# EAGLE design micADM510 (EAGLE 9.2.2)
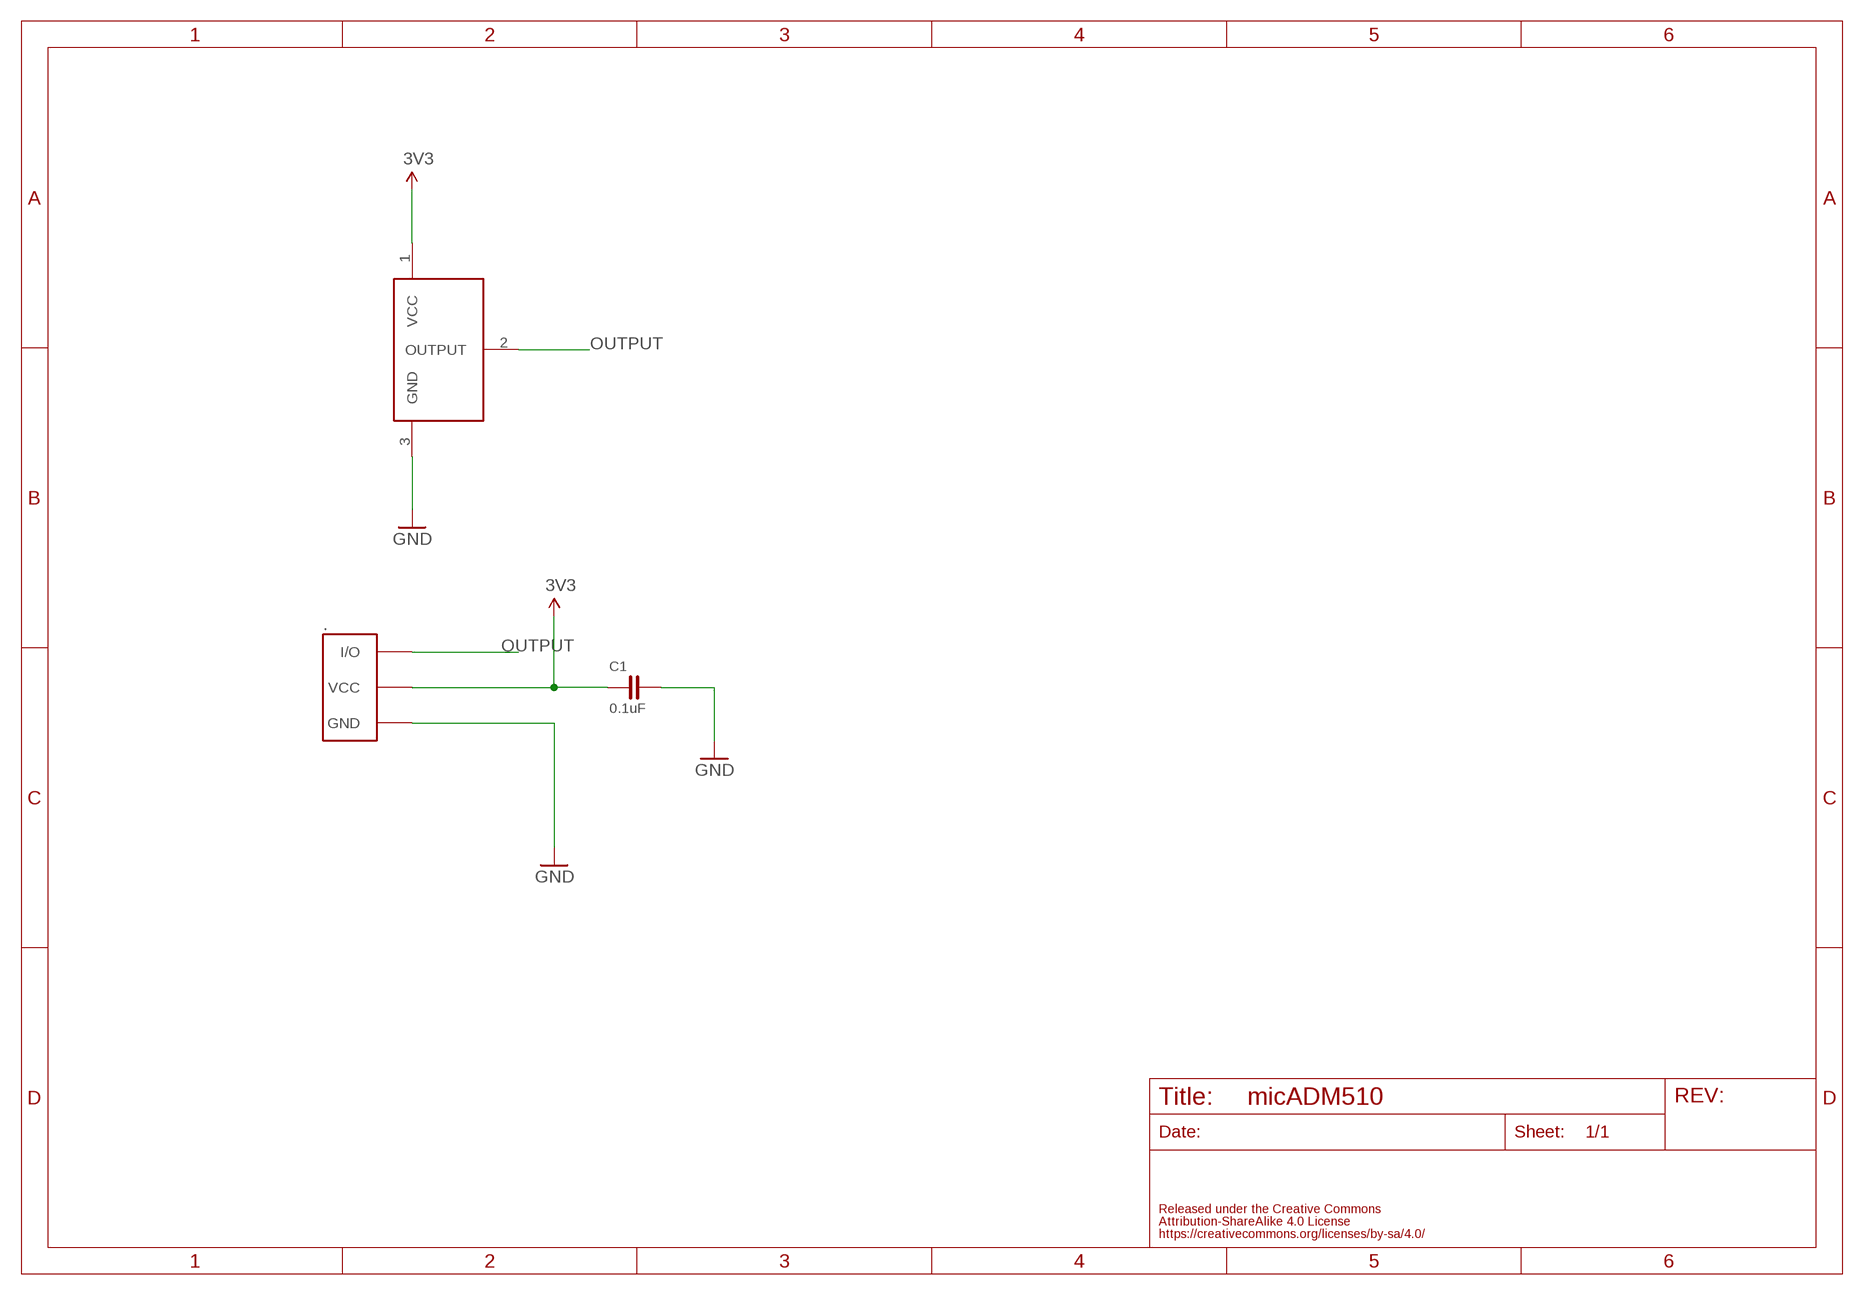
[diagram p0: schematic, sheet 1]

## Parts
.  FABO_BRICK_3PIN-S03B-PASK-2  [FABO_BRICK_3PIN_S03B-PASK-2]
ADM510  ANALOG-MICADMP510  [INVERSENSE-ADMP510]
C1  0.1uF  CAPACITOR-0603  [0603]

## Nets
3V3: ..VCC ADM510.1(VCC) C1.1
GND: ..GND ADM510.3(GND) C1.2
OUTPUT: ..I/O ADM510.2(OUTPUT)

## Library data of the parts
. = FaBo-Template:FABO_BRICK_3PIN: FaBo Brick 3pin
ADM510 = FaBo-Sound:ANALOG-MIC
C1 = FaBo-Capacitor:CAPACITOR: CAPACITOR

## Board
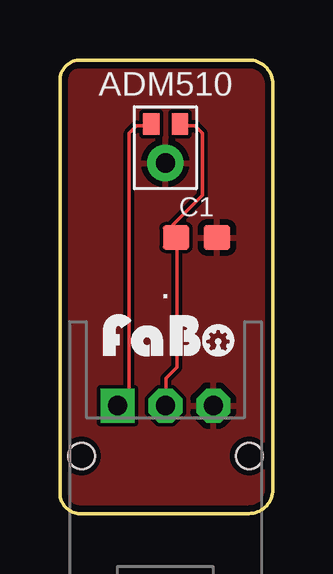
[diagram p1: board, top side]
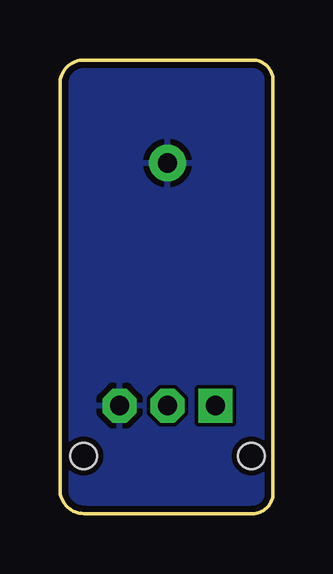
[diagram p2: board, bottom side, seen from below]

Size 8.89 x 18.9 mm. Coordinates in mm from the lower left corner, seen from the top.
Outline: 0,0.85 0,18.05 arc-90 0.85,18.9 7.88,18.9 arc-90 8.89,17.89 8.89,1.01 arc-90 7.88,0 0.85,0 arc-90 0,0.85
Copper layers (1*16): Top 0.035mm / dielectric 1.5mm / Bottom 0.035mm
Design rules "SeeedStudio_2layer_DRU_no_angle_20140221": minimum track width 6mil, minimum drill 12mil, track to track 6mil, track to pad 6mil, pad to pad 6mil, via to via 6mil, smd to smd 0mil, copper to edge 10mil, drill to drill 10mil, minimum pad ring 10mil, minimum via ring 6mil, stop-mask expansion 2mil, vias tented up to drill 100mil, thermal gap 10mil

### Footprints (pad centres in the part's own frame; a part is rotated, then mirrored left to right if it is on the bottom)
FABO_BRICK_3PIN_S03B-PASK-2 = drill 0.8 pad 1.422 octagon: GND -2,0; VCC 0,0 | drill 0.8 pad 1.422 square: I/O 2,0 | hole 1.1: 3.5,2.1; -3.5,2.1
INVERSENSE-ADMP510 = smd 0.68 x 0.9: 1 0.61,1; 2 -0.59,1 | drill 0.8 pad 1.524: 3 0,-0.635
0603 = smd 1.1 x 1: 1 -0.85,0; 2 0.85,0

### Placement (x,y rotation side)
.  4.4,4.5 180 top
ADM510  4.4,15.24 0 top
C1  5.7,11.5 0 top
U$2  [LOGO_FABO_S]  4.6,6.4 0 top

### Tracks (layer width: path | path; a pad name or v marks a point on that pad's centre or on a via)
3V3
  Top 0.152: ADM510.1 5.03,16.15 5.64,16.15 5.94,15.85 5.94,13.26 4.72,12.04 4.72,11.58 C1.1 4.88,11.43 4.88,6.1 4.42,5.64 4.42,4.57 ..VCC
GND
  pour Bottom: 0,0 0,19.05 8.89,19.05 8.89,0
  pour Top: 0,0 0,19.05 8.89,19.05 8.89,0
OUTPUT
  Top 0.152: ADM510.2 3.81,16.15 3.2,16.15 2.9,15.85 2.9,5.03 2.44,4.57 ..I/O